# Altium project 滤波器.PrjPCB
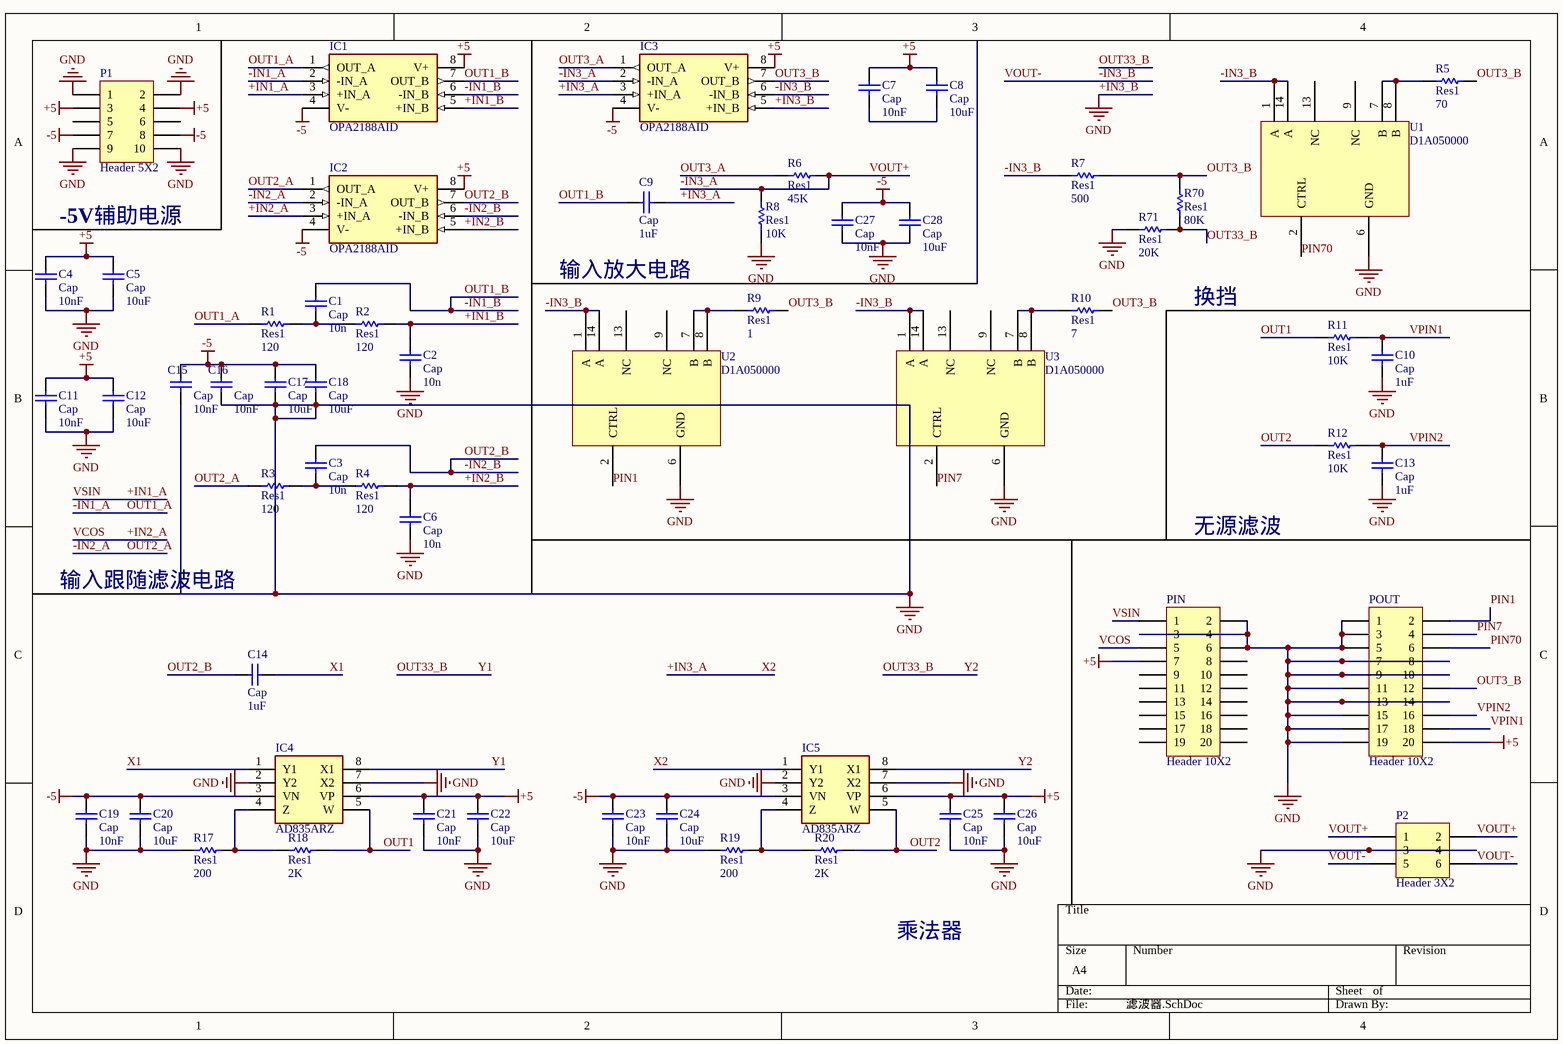
[diagram p0: 滤波器.SchDoc]
1 sheet, 58 parts. Net scope: global (net labels, ports and power ports of the same name join across sheets).
Board file: 滤波器.PcbDoc

## Sheet 滤波器.SchDoc
size A4

### Parts
C1  Cap  value 10n  [1608[0603]]
C2  Cap  value 10n  [1608[0603]]
C3  Cap  value 10n  [1608[0603]]
C4  Cap  value 10nF  [1608[0603]]
C5  Cap  value 10uF  [1608[0603]]
C6  Cap  value 10n  [1608[0603]]
C7  Cap  value 10nF  [1608[0603]]
C8  Cap  value 10uF  [1608[0603]]
C9  Cap  value 1uF  [1608[0603]]
C10  Cap  value 1uF  [C1210]
C11  Cap  value 10nF  [1608[0603]]
C12  Cap  value 10uF  [1608[0603]]
C13  Cap  value 1uF  [C1210]
C14  Cap  value 1uF  [AXIAL-0.3]
C15  Cap  value 10nF  [1608[0603]]
C16  Cap  value 10nF  [1608[0603]]
C17  Cap  value 10uF  [1608[0603]]
C18  Cap  value 10uF  [1608[0603]]
C19  Cap  value 10nF  [1608[0603]]
C20  Cap  value 10uF  [1608[0603]]
C21  Cap  value 10nF  [1608[0603]]
C22  Cap  value 10uF  [1608[0603]]
C23  Cap  value 10nF  [1608[0603]]
C24  Cap  value 10uF  [1608[0603]]
C25  Cap  value 10nF  [1608[0603]]
C26  Cap  value 10uF  [1608[0603]]
C27  Cap  value 10nF  [1608[0603]]
C28  Cap  value 10uF  [1608[0603]]
IC1  OPA2188AID  [dip-8]
IC2  OPA2188AID  [dip-8]
IC3  OPA2188AID  [dip-8]
IC4  AD835ARZ  [DIP-8]
IC5  AD835ARZ  [DIP-8]
P1  Header 5X2  [HDR2X5]
P2  Header 3X2  [HDR2X3]
PIN  Header 10X2  [HDR2X10]
POUT  Header 10X2  [HDR2X10]
R1  Res1  value 120  [1608[0603]]
R2  Res1  value 120  [1608[0603]]
R3  Res1  value 120  [1608[0603]]
R4  Res1  value 120  [1608[0603]]
R5  Res1  value 70  [1608[0603]]
R6  Res1  value 45K  [1608[0603]]
R7  Res1  value 500  [1608[0603]]
R8  Res1  value 10K  [1608[0603]]
R9  Res1  value 1  [1608[0603]]
R10  Res1  value 7  [1608[0603]]
R11  Res1  value 10K  [C1210]
R12  Res1  value 10K  [C1210]
R17  Res1  value 200  [1608[0603]]
R18  Res1  value 2K  [1608[0603]]
R19  Res1  value 200  [1608[0603]]
R20  Res1  value 2K  [1608[0603]]
R70  Res1  value 80K  [1608[0603]]
R71  Res1  value 20K  [1608[0603]]
U1  D1A050000  [D1A050000]
U2  D1A050000  [D1A050000]
U3  D1A050000  [D1A050000]

### Nets
+5: C4.1 C5.1 C7.1 C8.1 C11.1 C12.1 C21.1 C22.1 C25.1 C26.1 IC1.8(V+) IC2.8(V+) IC3.8(V+) IC4.6(VP) IC5.6(VP) P1.3 P1.4 PIN.7 POUT.20
+IN3_B: C2.1 C4.2 C5.2 C6.1 C10.2 C11.2 C12.2 C13.2 C15.2 C16.2 C17.2 C18.2 C19.2 C20.2 C21.2 C22.2 C23.2 C24.2 C25.2 C26.2 C27.2 C28.2 IC3.5(+IN_B) IC4.2(Y2) IC4.7(X2) IC5.2(Y2) IC5.7(X2) P1.1 P1.2 P1.9 P1.10 P2.3 P2.4 PIN.2 PIN.3 PIN.4 PIN.6 POUT.1 POUT.3 POUT.5 POUT.7 POUT.8 POUT.9 POUT.10 POUT.11 POUT.13 POUT.14 POUT.15 POUT.17 POUT.19 R8.1 R17.1 R19.1 R71.2 U1.6(GND) U2.6(GND) U3.6(GND)  [also labelled GND]
-5: C15.1 C16.1 C17.1 C18.1 C19.1 C20.1 C23.1 C24.1 C27.1 C28.1 IC1.4(V-) IC2.4(V-) IC3.4(V-) IC4.3(VN) IC5.3(VN) P1.7 P1.8
+IN1_A: IC1.3(+IN_A) PIN.1  [also labelled VSIN]
+IN1_B: C2.2 IC1.5(+IN_B) R2.2
+IN2_A: IC2.3(+IN_A) PIN.5  [also labelled VCOS]
+IN2_B: C6.2 IC2.5(+IN_B) R4.2
+IN3_A: C9.1 IC3.3(+IN_A) IC5.1(Y1)  [also labelled X2]
-IN1_A: IC1.1(OUT_A) IC1.2(-IN_A) R1.1  [also labelled OUT1_A]
-IN1_B: C1.2 C9.2 IC1.6(-IN_B) IC1.7(OUT_B)  [also labelled OUT1_B]
-IN2_A: IC2.1(OUT_A) IC2.2(-IN_A) R3.1  [also labelled OUT2_A]
-IN2_B: C3.2 C14.2 IC2.6(-IN_B) IC2.7(OUT_B)  [also labelled OUT2_B]
-IN3_A: IC3.2(-IN_A) P2.1 P2.2 R6.1 R8.2  [also labelled VOUT+]
-IN3_B: IC3.6(-IN_B) P2.5 P2.6 R7.1 U1.1(A) U1.14(A) U2.1(A) U2.14(A) U3.1(A) U3.14(A)  [also labelled VOUT-]
OUT1: IC4.5(W) R11.1 R18.2
OUT2: IC5.5(W) R12.1 R20.2
OUT3_A: IC3.1(OUT_A) R6.2
OUT3_B: IC3.7(OUT_B) POUT.12 R5.2 R7.2 R9.2 R10.2 R70.2
OUT33_B: IC4.8(X1) IC5.8(X1) R70.1 R71.1  [also labelled Y1, Y2]
PIN1: POUT.2 U2.2(CTRL)
PIN7: POUT.4 U3.2(CTRL)
PIN70: POUT.6 U1.2(CTRL)
VPIN1: C10.1 POUT.18 R11.2
VPIN2: C13.1 POUT.16 R12.2
X1: C14.1 IC4.1(Y1)
NetC1_1: C1.1 R1.2 R2.1
NetC3_1: C3.1 R3.2 R4.1
NetC7_2: C7.2 C8.2
NetIC4_4: IC4.4(Z) R17.2 R18.1
NetIC5_4: IC5.4(Z) R19.2 R20.1
NetR5_1: R5.1 U1.7(B) U1.8(B)
NetR9_1: R9.1 U2.7(B) U2.8(B)
NetR10_1: R10.1 U3.7(B) U3.8(B)

Not connected (* = marked no-connect by the designer): P1 5 6; PIN 8 9 10 11 12 13 14 15 16 17 18 19 20; U1 9(NC) 13(NC); U2 9(NC) 13(NC); U3 9(NC) 13(NC)

### Notes on the sheet
- -5V辅助电源
- 输入放大电路
- 换挡
- 输入跟随滤波电路
- 无源滤波
- 乘法器

### Library data of the parts
C1-C28 = Cap: Capacitor; Published: 8-Jun-2000; LatestRevisionDate: 17-Jul-2002; LatestRevisionNote: Re-released for DXP Platform.; PackageReference: RAD-0.3; Publisher: Altium Limited; PackageDescription: Radial Cap, Thru-Hole; 2 Leads; 0.3 in Pin Spacing
IC1-IC3 = OPA2188AID: Integrated Circuit; Manufacturer_Name: Texas Instruments; Datasheet Link: http://www.ti.com/lit/ds/symlink/opa2188.pdf; Height: 1.75mm; Manufacturer_Part_Number: OPA2188AID; Mouser Part Number: 595-OPA2188AID; Mouser Price/Stock: https://www.mouser.com/Search/Refine.aspx?Keyword=595-OPA2188AID; RS Part Number: 8122568P; RS Price/Stock: http://uk.rs-online.com/web/p/products/8122568P
IC4 IC5 = AD835ARZ: Integrated Circuit; Manufacturer_Name: Analog Devices; Datasheet Link: http://www.analog.com/static/imported-files/data_sheets/AD835.pdf; Height: 1.75mm; Manufacturer_Part_Number: AD835ARZ; Mouser Part Number: 584-AD835ARZ; Mouser Price/Stock: https://www.mouser.com/Search/Refine.aspx?Keyword=584-AD835ARZ; RS Part Number: 5236973; RS Price/Stock: https://uk.rs-online.com/web/p/products/5236973
P1 = Header 5X2: Header, 5-Pin, Dual row; LatestRevisionDate: 17-Jul-2002; LatestRevisionNote: Re-released for DXP Platform.; Publisher: Altium Limited
P2 = Header 3X2: Header, 3-Pin, Dual row; LatestRevisionDate: 17-Jul-2002; LatestRevisionNote: Re-released for DXP Platform.; Publisher: Altium Limited
PIN POUT = Header 10X2: Header, 10-Pin, Dual row; LatestRevisionDate: 17-Jul-2002; LatestRevisionNote: Re-released for DXP Platform.; Publisher: Altium Limited
R1-R12 R17-R20 R70 R71 = Res1: Resistor; Published: 8-Jun-2000; LatestRevisionDate: 17-Jul-2002; LatestRevisionNote: Re-released for DXP Platform.; PackageReference: AXIAL-0.3; Publisher: Altium Limited; PackageDescription: Axial Device, Thru-Hole; 2 Leads; 0.3 in Pin Spacing